# Altium schematic sheet blackfin_e_power.SchDoc
size A3
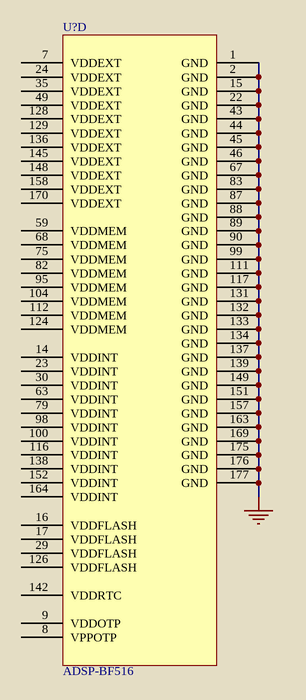
[diagram p0: blackfin_e_power.SchDoc]

## Parts
U?  ADSP-BF516  [LQFP-176]  (part D of 4)

## Nets
GND: U?.1(GND) U?.2(GND) U?.15(GND) U?.22(GND) U?.43(GND) U?.44(GND) U?.45(GND) U?.46(GND) U?.67(GND) U?.83(GND) U?.87(GND) U?.88(GND) U?.89(GND) U?.90(GND) U?.99(GND) U?.111(GND) U?.117(GND) U?.131(GND) U?.132(GND) U?.133(GND) U?.134(GND) U?.137(GND) U?.139(GND) U?.149(GND) U?.151(GND) U?.157(GND) U?.163(GND) U?.169(GND) U?.175(GND) U?.176(GND) U?.177(GND)

Not connected (* = marked no-connect by the designer): U? 7(VDDEXT) 8(VPPOTP) 9(VDDOTP) 14(VDDINT) 16(VDDFLASH) 17(VDDFLASH) 23(VDDINT) 24(VDDEXT) 29(VDDFLASH) 30(VDDINT) 35(VDDEXT) 49(VDDEXT) 59(VDDMEM) 63(VDDINT) 68(VDDMEM) 75(VDDMEM) 79(VDDINT) 82(VDDMEM) 95(VDDMEM) 98(VDDINT) 100(VDDINT) 104(VDDMEM) 112(VDDMEM) 116(VDDINT) 124(VDDMEM) 126(VDDFLASH) 128(VDDEXT) 129(VDDEXT) 136(VDDEXT) 138(VDDINT) 142(VDDRTC) 145(VDDEXT) 148(VDDEXT) 152(VDDINT) 158(VDDEXT) 164(VDDINT) 170(VDDEXT)

## Library data of the parts
U? = ADSP-BF516: Part#: ADSP-BF516BSWZ-3; Manufacturer: Analog Devices; eVendor: *; eVendorPart#: *; eVendorPrice: *; MOQ: *; MSRP: *